# EAGLE design main (EAGLE 9.6.2)
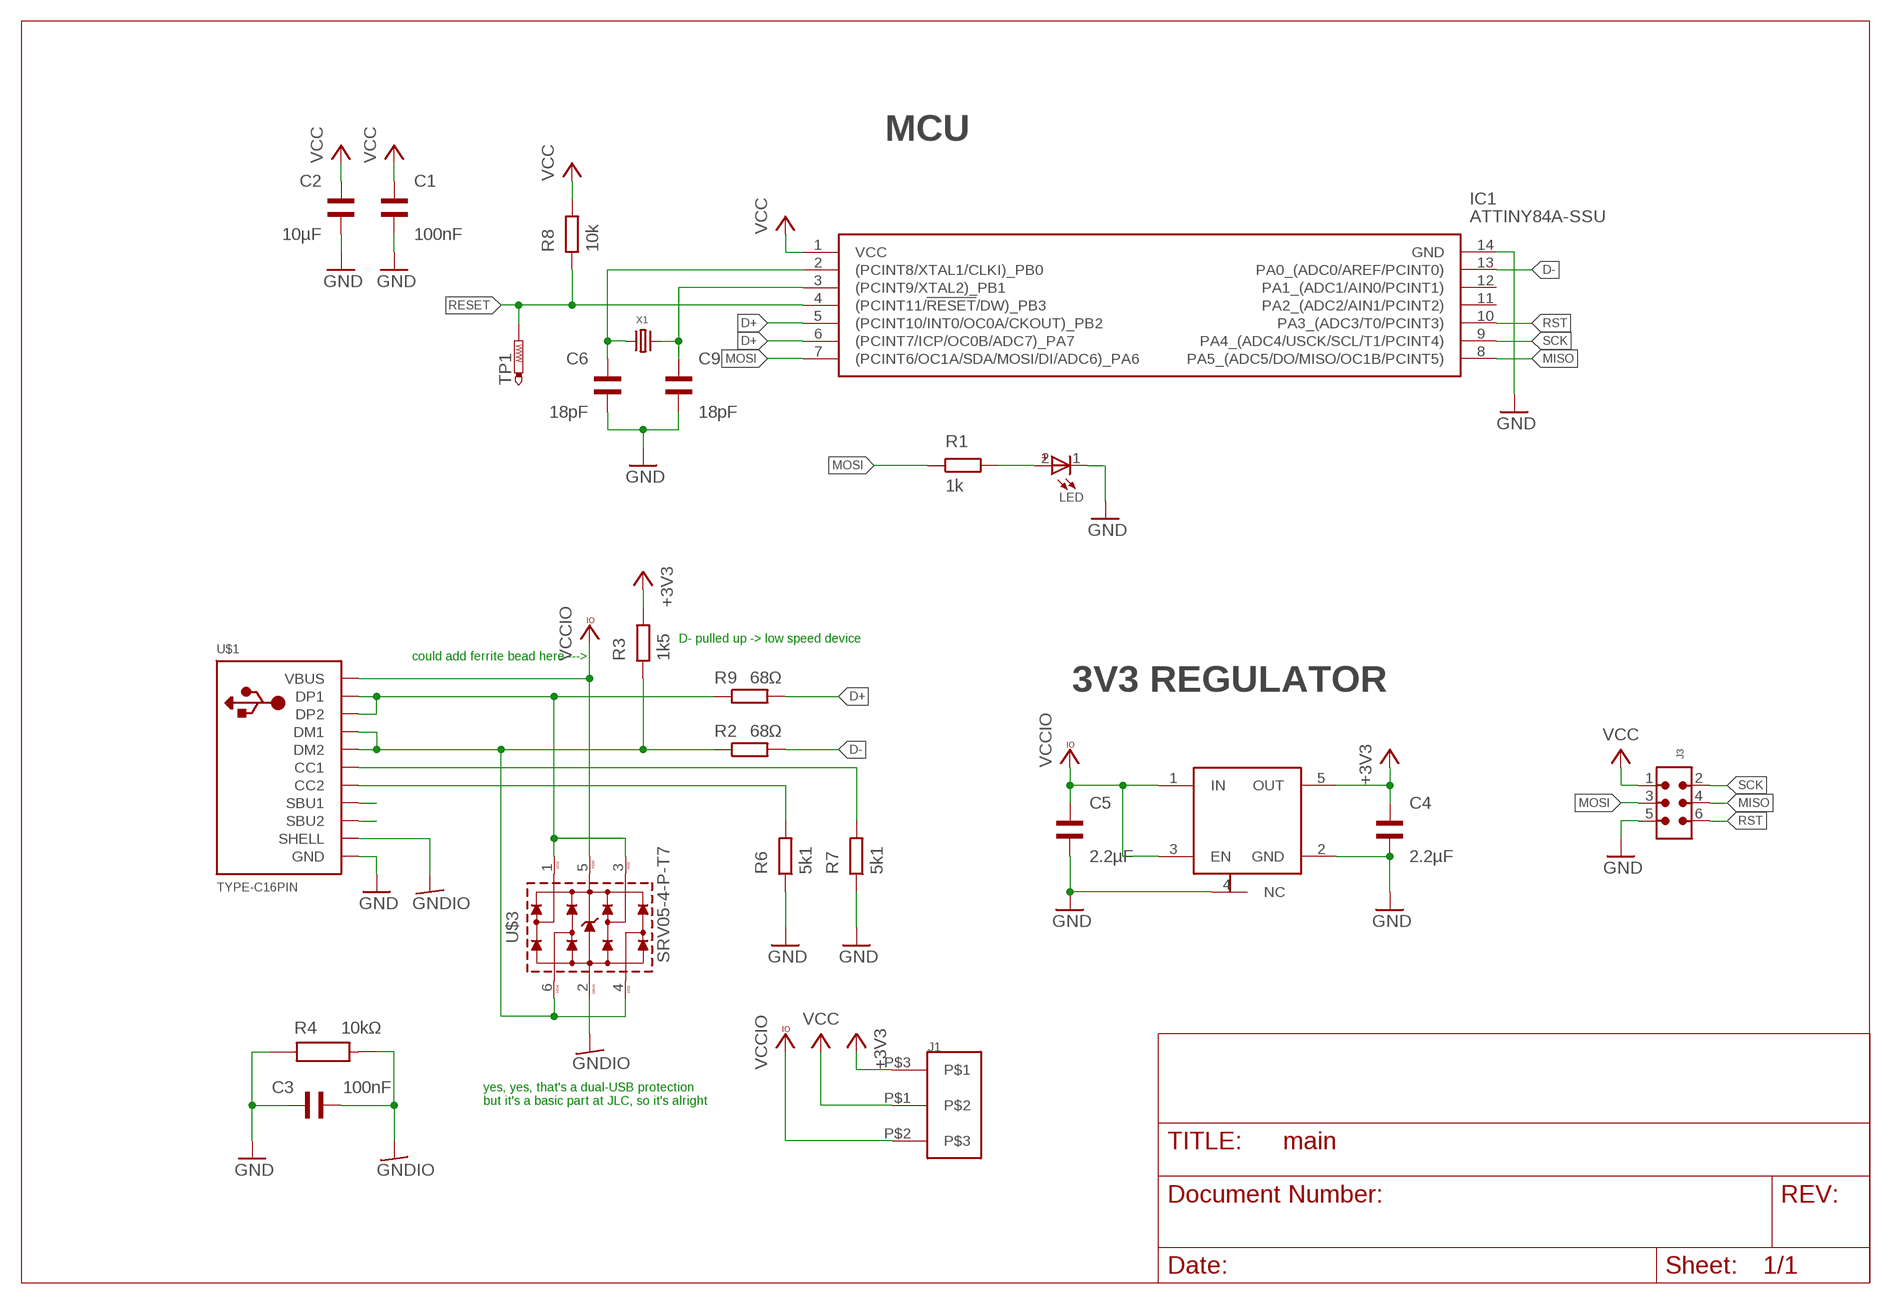
[diagram p0: schematic, sheet 1]

## Parts
C1  100nF  WCAP-CSGP_0603_885012206046_REFLOW  [WCAP-CSGP_0603_REFLOW]
C2  10µF  WCAP-CSGP_0603_885012106012_REFLOW  [WCAP-CSGP_0603_REFLOW]
C3  100nF  WCAP-CSGP_0603_885012206046_REFLOW  [WCAP-CSGP_0603_REFLOW]
C4  2.2µF  WCAP-CSGP_0603_885012206027_REFLOW  [WCAP-CSGP_0603_REFLOW]
C5  2.2µF  WCAP-CSGP_0603_885012206027_REFLOW  [WCAP-CSGP_0603_REFLOW]
C6  18pF  WCAP-CSGP_0603_885012206046_REFLOW  [WCAP-CSGP_0603_REFLOW]
C9  18pF  WCAP-CSGP_0603_885012206046_REFLOW  [WCAP-CSGP_0603_REFLOW]
IC1  ATTINY84A-SSU  [SOIC127P600X175-14N]
J1  JUMPER1.27  [1.27_JUMPER]
J3  6120XX21621_61200621621  [61200621621]
LED  WL-SMCW_0603_150060GS75000  [WL-SMCW_0603]
R1  1k  RESISTOR_0402  [WRIS-KSKE_0402]
R2  68Ω  RESISTOR_0402  [WRIS-KSKE_0402]
R3  1k5  RESISTOR_0402  [WRIS-KSKE_0402]
R4  10kΩ  WRIS-PSMB_0603_580060716001_1.6X0.8X0.35X0.6  [WRIS-PSMB_0603_1.6X0.8X0.35X0.6(LXWXHXPW)]
R6  5k1  RESISTOR_0402  [WRIS-KSKE_0402]
R7  5k1  RESISTOR_0402  [WRIS-KSKE_0402]
R8  10k  RESISTOR_0402  [WRIS-KSKE_0402]
R9  68Ω  RESISTOR_0402  [WRIS-KSKE_0402]
TP1  PTR1B1,27  [B1,27]
U$1  TYPE-C16PIN  [TYPE-C16PIN]
U$2  TLV75533PDBVRSOT-23-5  [DBV_R-PDSO-G5]
U$3  SRV05-4-P-T7  [SOT23-6]
X1  KMD160001210  [M-49USSMD]

## Nets
+3V3: C4.2 J1.P$3 R3.2 U$2.5(OUT)
D+: IC1.5((PCINT10/INT0/OC0A/CKOUT)_PB2) IC1.6((PCINT7/ICP/OC0B/ADC7)_PA7) R9.2
D+_RAW: R9.1 U$1.A6(DP1) U$1.B6(DP2) U$3.1(IO1) U$3.3(IO2)
D-: IC1.13(PA0_(ADC0/AREF/PCINT0)) R2.2
D-_RAW: R2.1 R3.1 U$1.A7(DM1) U$1.B7(DM2) U$3.4(IO3) U$3.6(IO4)
GND: C1.1 C2.1 C3.2 C4.1 C5.1 C6.1 C9.1 IC1.14(GND) J3.5 LED.1(-) R4.1 R6.1 R7.1 U$1.A1B12(GND) U$1.B1A12(GND) U$2.2(GND) U$2.4(NC)
GNDIO: C3.1 R4.2 U$1.SHELL1(SHELL) U$1.SHELL2(SHELL) U$1.SHELL3(SHELL) U$1.SHELL4(SHELL) U$3.2(GND)
MISO: IC1.8(PA5_(ADC5/DO/MISO/OC1B/PCINT5)) J3.4
MOSI: IC1.7((PCINT6/OC1A/SDA/MOSI/DI/ADC6)_PA6) J3.3 R1.1
N$1: LED.2(+) R1.2
N$12: R7.2 U$1.A5(CC1)
N$13: R6.2 U$1.B5(CC2)
N$14: U$1.A8(SBU1)
N$15: U$1.B8(SBU2)
N$18: C6.2 IC1.2((PCINT8/XTAL1/CLKI)_PB0) X1.P$1
N$19: C9.2 IC1.3((PCINT9/XTAL2)_PB1) X1.P$2
RESET: IC1.4((PCINT11/!RESET!/DW)_PB3) R8.1 TP1.TP
RST: IC1.10(PA3_(ADC3/T0/PCINT3)) J3.6
SCK: IC1.9(PA4_(ADC4/USCK/SCL/T1/PCINT4)) J3.2
VCC: C1.2 C2.2 IC1.1(VCC) J1.P$1 J3.1 R8.2
VCCIO: C5.2 J1.P$2 U$1.A4B9(VBUS) U$1.B4A9(VBUS) U$2.1(IN) U$2.3(EN) U$3.5(VDD)
Unconnected: IC1.11(PA2_(ADC2/AIN1/PCINT2)) IC1.12(PA1_(ADC1/AIN0/PCINT1))

## Notes on the sheet
- MCU
- D- pulled up -> low speed device
- could add ferrite bead here --->
- 3V3 REGULATOR
- yes, yes, that's a dual-USB protection
  but it's a basic part at JLC, so it's alright

## Library data of the parts
C1-C6 C9 = 885012206052_Eagle_WCAP-CSGP_rev19b (1):WCAP-CSGP_0603: WCAP-CSGP Ceramic Capacitors Characteristics Multilayer Ceramic Chip Capacitor Recommended soldering:Reflow, for 0603 and 0805 wave soldering is also allowed Operating temperature:-55 °C to +125 °C; Ceramic characteristics: Class I - NPO ; Class II -X7R, X5R High performance ceramic High capacitance stability Minimal aging Termination:Cu/Ni/Sn <http://katalog.we-online.de/media/images/eisos/WCAP-CSGP_pf2.jpg> Details see: http://katalog.we-online.de/en/pbs/WCAP-CSGP-0603? Created: 2015-01-28 2015 (C) Wurth Elektronik
IC1 = Salmiak:ATTINY84A-SSU: MCU 8-Bit AVR RISC 8KB Flash 2.5/3.3/5V Atmel ATTINY84A-SSU, 8bit AVR Microcontroller, 20MHz, 8 kB Flash, 14-Pin SOIC Source: Datasheet <https://componentsearchengine.com/Datasheets/2/ATTINY84A-SSU.pdf>; ARROW_PART_NUMBER: ATTINY84A-SSU; ARROW_PRICE-STOCK: https://www.arrow.com/en/products/attiny84a-ssu/microchip-technology; DESCRIPTION: MCU 8-Bit AVR RISC 8KB Flash 2.5/3.3/5V Atmel ATTINY84A-SSU, 8bit AVR Microcontroller, 20MHz, 8 kB Flash, 14-Pin SOIC; HEIGHT: 1.75mm; MANUFACTURER_NAME: Microchip; MANUFACTURER_PART_NUMBER: ATTINY84A-SSU; MOUSER_PART_NUMBER: 556-ATTINY84A-SSU; MOUSER_PRICE-STOCK: https://www.mouser.co.uk/ProductDetail/Microchip-Technology-Atmel/ATTINY84A-SSU?qs=JVB2vxgwrwzxqIGcOcTovQ%3D%3D
J1 = Lib_A:JUMPER1.27
J3 = 61200621621_Eagle_WR-BHD_rev19b:6120XX21621_61200621621: WR-BHD 2.54 mm Male Box Header KIND PROPERTIES: Pitch 2.54 mm Gender:Male MATERIAL PROPERTIES: Insulator Material:PBT Insulator Flammability Rating UL94 V-0 Insulator Color:Black Contact Material :Copper Alloy Contact Plating :Gold Contact Type: Stamped GENERAL INFORMATION: Operating Temperature:-40 °C up to +125 °C Compliance:RoHS Working Voltage: 250 V (AC) Withstanding Voltage:500 V (AC) Contact Resistance: 20 mΩ Insulation Resistance:1000 MΩ CERTIFICATION: UL Approval:E323964 PACKAGING PROPERTIES Packaging :Tray <https://katalog.we-online.com/media/images/v2/o32884v209%20Family_WR-BHD_6120xx21621.jpg> Details see: https://katalog.we-online.com/en/em/BHD_2_54_MALE_BOX_HEADER_6120XX21621 Updated by Yingchun,Shan 2019-10-29 2019 (C) Würth Elektronik; CONTACT-RESISTANCE: 20mOhm; DATASHEET-URL: https://katalog.we-online.com/em/datasheet/61200621621.pdf; GENDER: Male; IR: 3A; L: 15.28mm; MATES: WR-BHD 2.54mm Female IDC Connector with Strain Relief; MOUNT: THT; PACKAGING: Tray; PART-NUMBER: 61200621621; PINS: 6; PITCH: 2.54mm; TOL-R: max.; TYPE: Straight; WORKING-VOLTAGE: 250V(AC)
LED = 150080BS75000_Eagle_WL-SMCW_rev20b:WL-SMCW_0603: WL-SMCW SMT Mono-color Chip LED Waterclea Characteristics Low energy consumption High reliability Low current requirement Fast switching No UV/IR radiation Smallest SMD LED package for exceptional brightness Top view LED Wide viewing angle Better solder ability Heat dissipation Applications Backlight for mobile and portable device keypads Indoor and outdoor message boards Flat backlight for LCDs, switches and symbols Display for industrial control systems and traffic Miniaturized color effects Pedestrian mark Optical indicators Tabular backlight: LCD, telephone key-press, power-switch, display board Indoor displays Signals Identifiers Backlight for automobile DVD LED General lighting Toys <https://www.we-online.com/catalog/media/o14904v209%20Family_WL-SMCW.jpg> Details see: https://www.we-online.com/catalog/en/WL-SMCW/ Updated BY Yingchun,Shan 2020-03-18 2020(C) Wurth Elektronik; ABSTRAHLWINKEL: 140°; CHIP-TECHNOLOGY: InGaN; DATASHEET-URL: https://www.we-online.com/catalog/datasheet/150060GS75000.pdf; EMITTING-COLOR: Green; I-V-TYP: 430mcd; LAMDA-DOM-TYP: 525nm; LAMDA-PEAK-TYP: 515nm; PART-NUMBER: 150060GS75000; V-F-TYP: 3.2V
R1-R3 R6-R9 = Lib_A:RESISTOR_0402
R4 = 580060716001_Eagle_WRIS-PSMB_rev19a:WRIS-PSMB_0603: WRIS-PSMB Metal Plate Resistors Characteristics Metal plate resistors Recommended soldering: Reflow Operating temperature: -55 °C up to +155 °C Resistance range: 5 mΩ up to 10 mΩ Resistance tolerance: ±1 % Rated power: 0.33 W up to 1 W Enhanced current sensing Applications DMotor control Package name and Variant abbreviation: L X W X H X PW =Length X Width X Height X Pad Width <https://katalog.we-online.com/media/images/v2/o135743v209%20Family_WRIS-PSMB.jpg> Details see: https://katalog.we-online.com/en/pbs/WRIS-PSMB Created by Yingchun, Shan 2018-11-14 2018(C) Wurth Elektronik; DATASHEET-URL: https://katalog.we-online.de/pbs/datasheet/580060716001.pdf; IR: 8.12A; MOUNT: SMT; PART-NUMBER: 580060716001; PRATED: 0.33W; TCR: ±100ppm/ °C; TECHNICAL-REFERENCE: MB0603R005F103KAATP0000; VALUE: 5mOhm
TP1 = testpad:PTR1: TEST PIN
U$1 = Lib_A:TYPE-C16PIN
U$2 = Eigene Bauteile:TLV75533PDBVR
U$3 = Eigene Bauteile:SRV05-4-P-T7
X1 = Eigene Bauteile:KMD160001210

## Board
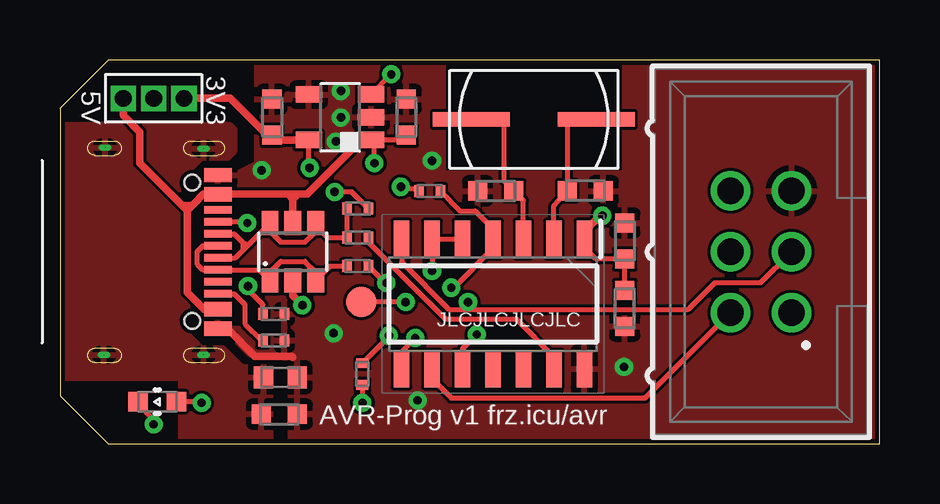
[diagram p1: board, top side]
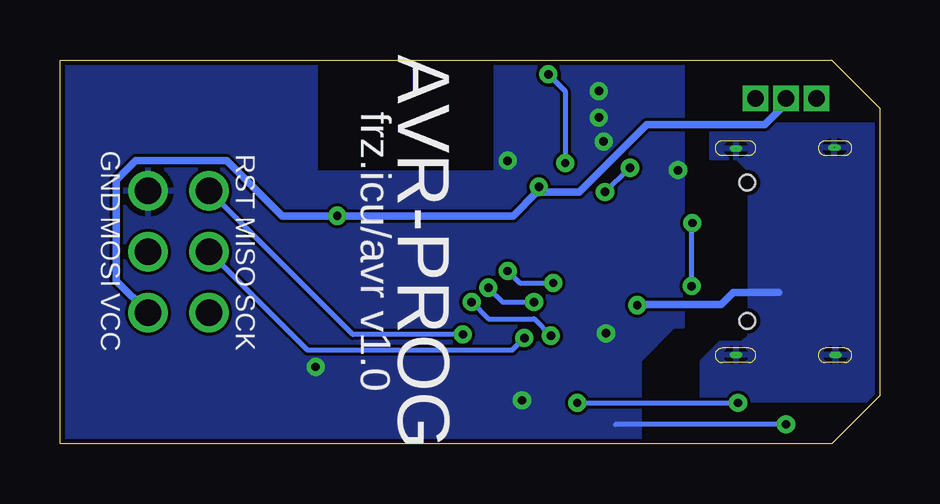
[diagram p2: board, bottom side, seen from below]

Size 34.15 x 16 mm. Coordinates in mm from the lower left corner, seen from the top.
Outline: 2,0 34.15,0 34.15,16 2,16 0,14 0,2 2,0
Copper layers (1*16): Top 0.035mm / dielectric 1.5mm / Bottom 0.035mm
Design rules "default *": minimum track width 5mil, minimum drill 0.2mm, track to track 5mil, track to pad 6mil, pad to pad 6mil, via to via 6mil, smd to smd 6mil, copper to edge 0.2mm, drill to drill 6mil, minimum pad ring 0.13mm, minimum via ring 8mil, stop-mask expansion 4mil, vias tented up to drill 100mil, thermal gap 10mil
tRestrict: area 16.1,11.4 to 23.4,15.7; area -2.4,-1.7 to 4.9,2.6
bRestrict: area 16.1,11.4 to 23.4,15.7; area 0.1,-2.6 to 7.4,1.7

### Footprints (pad centres in the part's own frame; a part is rotated, then mirrored left to right if it is on the bottom)
WCAP-CSGP_0603_REFLOW = smd 0.8 x 0.8: 1 -0.75,0; 2 0.75,0
SOIC127P600X175-14N = smd 1.528 x 0.65: 1 -2.711,3.81; 2 -2.711,2.54; 3 -2.711,1.27; 4 -2.711,0; 5 -2.711,-1.27; 6 -2.711,-2.54; 7 -2.711,-3.81; 8 2.711,-3.81; 9 2.711,-2.54; 10 2.711,-1.27; 11 2.711,0; 12 2.711,1.27; 13 2.711,2.54; 14 2.711,3.81
1.27_JUMPER = drill 0.7 pad 0.9 square: P$1 0,0; P$2 -1.27,0; P$3 1.27,0
61200621621 = drill 1.1: 1 -2.54,-1.27; 2 -2.54,1.27; 3 0,-1.27; 4 0,1.27; 5 2.54,-1.27; 6 2.54,1.27
WL-SMCW_0603 = smd 0.8 x 0.8: 1 -0.8,0; 2 0.8,0
WRIS-KSKE_0402 = smd 0.4 x 0.5: 1 -0.45,0; 2 0.45,0
WRIS-PSMB_0603_1.6X0.8X0.35X0.6(LXWXHXPW) = smd 0.8 x 0.9: 1 -0.7,0; 2 0.7,0
B1,27 = smd 1.27 x 1.27: TP 0,0
TYPE-C16PIN = smd 0.6 x 1.15: A1B12 -3.2,0; A4B9 -2.4,0; B1A12 3.2,0; B4A9 2.4,0 | smd 0.3 x 1.15: A5 -1.25,0; A6 -0.25,0; A7 0.25,0; A8 -1.75,0; B5 1.75,0; B6 0.75,0; B7 -0.75,0; B8 1.25,0 | drill 0.01 long: SHELL1 -4.3,-0.6; SHELL2 4.3,-0.6; SHELL3 -4.35,-4.7; SHELL4 4.3,-4.75 | hole 0.65: -2.89,-1.075; 2.89,-1.075
DBV_R-PDSO-G5 = smd 0.69 x 1.1: 1 -0.95,-1.29; 2 0,-1.29; 3 0.95,-1.29; 4 0.95,1.3; 5 -0.95,1.3
SOT23-6 = smd 0.7 x 1: 1 -0.95,-1.2; 2 0,-1.2; 3 0.95,-1.2; 4 0.95,1.2; 5 0,1.2; 6 -0.95,1.2
M-49USSMD = smd 3.2 x 0.62: P$1 -2.6,0; P$2 2.6,0

### Placement (x,y rotation side)
C1  23.53,5.64 90 top
C2  23.53,8.45 270 top
C3  9.14,1.23 0 top
C4  8.83,13.61 270 top
C5  14.43,13.61 270 top
C6  21.89,10.54 180 top
C9  18.16,10.54 0 top
IC1  18.04,5.82 270 top
J1  3.9,14.4 0 top
J3  29.21,8 90 top
LED  4.05,1.75 0 top
R1  12.6,2.9 270 top
R2  12.4,8.6 0 top
R3  12.4,9.8 0 top
R4  9.18,2.76 180 top
R6  8.9,4.3 180 top
R7  8.9,5.4 180 top
R8  15.4,10.54 180 top
R9  12.4,7.4 0 top
TP1  12.55,5.91 0 top
U$1  6.58,8 270 top
U$2  11.67,13.61 90 top
U$3  9.7,8 0 top
X1  19.74,13.52 180 top

### Tracks (layer width: path | path; a pad name or v marks a point on that pad's centre or on a via)
+3V3  (via drill 0.35)
  Top 0.203: R3.2 12.16,10.49 v11.44,10.49 | v10.4,11.5 10.37,11.53 U$2.5
  Top 0.305: U$2.5 9.03,12.66 C4.2 8.63,12.86 7.09,14.4 J1.P$3
  Bottom 0.203: v11.44,10.49 10.43,11.5 v10.4,11.5
D+  (via drill 0.35)
  Top 0.203: IC1.5 IC1.6 v15.5,7.2 | R9.2 13.55,6.7 v13.6,6.7
  Bottom 0.203: v15.5,7.2 15,6.7 v13.6,6.7
D+_RAW
  Top 0.203: U$1.A6 5.95,8.25 5.7,8 5.7,7.5 5.95,7.25 U$1.B6 8.3,7.25 U$3.1 8.75,7.15 9.2,7.6 10.2,7.6 10.65,7.15 U$3.3 11.25,7.4 R9.1
D-
  Top 0.152: R2.2 12.85,8.4
  Top 0.203: 12.85,8.4 16.05,5.2 19,5.2 20.58,3.62 IC1.13
D-_RAW
  Top 0.203: U$1.A7 7.3,7.75 7.61,8.06 | 7.61,8.06 7.78,8.22 | 7.78,8.22 7.88,8.32 | 7.88,8.32 U$3.6 8.75,8.85 9.2,8.4 10.2,8.4 10.65,8.85 U$3.4 10.65,9.1 11.15,8.6 R2.1 R3.1 | U$1.B7 7.25,8.75 7.61,8.39 | 7.61,8.39 7.7,8.3 | 7.78,8.22 7.7,8.3 | 7.61,8.39 7.61,8.06 | 7.7,8.3 7.73,8.32 7.88,8.32
GND  (via drill 0.35)
  Top 0.203: LED.1 3.25,1.65 3.9,1 v3.9,0.8
  Top 0.305: 9.7,3.6 9.66,3.64 8.12,3.64 6.97,4.8 U$1.B1A12
  Bottom 0.203: v3.9,0.8 11,0.8
  other vias: 8.4,11.4 11.4,4.6 14.9,1.8 15.5,11.8 23.5,3.2 11.7,14.7 11.5,12.6 11.7,13.6
  pour Bottom: 10,0 10,3.5 8.6,4.9 8.2,4.9 8.2,15.9 8.3,16 34.2,16 34.2,0
  pour Top: 9.6,0 9.6,3.3 9.2,3.7 7.9,3.7 6.9,4.7 6.2,4.7 6.2,11.3 7.4,11.3 8.2,11.7 8.2,15.9 8.3,16 34.2,16 34.2,0
GNDIO  (via drill 0.35)
  Top 0.305: U$3.2 9.7,6.17 v10.1,5.77
  Bottom 0.305: 4.2,6.3 6.1,6.3 6.6,5.8 10.07,5.8 v10.1,5.77
  pour Top: 8.8,0 8.8,3.2 7.6,3.2 6.8,4 5.9,4 5.4,4.5 5.4,11.4 5.9,11.9 7,11.9 7.3,12.2 7.3,13.1 7.1,13.3 0,13.3 0,2 2,0
  pour Bottom: 7.4,0 7.4,3.4 6.6,4.2 5.7,4.2 5.4,4.5 5.4,11.4 5.9,11.9 7,11.9 7,13.3 0,13.3 0,2 2,0
MISO  (via drill 0.35)
  Top 0.203: IC1.8 14.23,3.83 v14.8,4.4
  Bottom 0.203: v14.8,4.4 15.3,3.9 23.84,3.9 J3.4
MOSI  (via drill 0.35)
  Top 0.203: IC1.7 14.23,7.57 16.2,5.6 17,5.6 | J3.3 29.18,6.7 27.28,6.7 26.18,5.6 17,5.6 | v13.7,4.5 13.7,4.45 R1.1 | v17,5.9 17,5.6
  Bottom 0.203: v17,5.9 16.3,5.2 14.4,5.2 v13.7,4.5
N$1  (via drill 0.35)
  Top 0.203: R1.2 v12.6,1.7 | v5.9,1.7 5.85,1.75 LED.2
  Bottom 0.203: v12.6,1.7 v5.9,1.7
N$12  (via drill 0.35)
  Top 0.203: R7.2 8.45,5.8 7.83,6.42 v7.83,6.57 | v7.8,9.2 7.75,9.25 U$1.A5
  Bottom 0.203: v7.83,6.57 7.83,9.17 v7.8,9.2
N$13
  Top 0.203: U$1.B5 7.25,6.25 7.7,5.8 7.7,5 8.4,4.3 R6.2
N$18
  Top 0.203: IC1.2 20.58,9.91 C6.2 21.14,13.42 21.24,13.52 X1.P$1
N$19
  Top 0.203: IC1.3 19.31,10.14 C9.2 18.5,10.95 18.5,13.52 X1.P$2
RESET  (via drill 0.35)
  Top 0.203: R8.1 16.65,9.7 17.3,9.7 18.04,8.96 IC1.4 18.04,8.13 16.41,6.5 v16.3,6.5 | TP1.TP v14.4,5.9
  Bottom 0.203: v14.4,5.9 15.7,5.9 v16.3,6.5
RST  (via drill 0.35)
  Top 0.203: v17.37,4.55 16.77,3.96 IC1.10
  Bottom 0.203: v17.37,4.55 21.95,4.55 J3.6
SCK
  Top 0.203: IC1.9 15.5,2.7 16.3,1.9 24.38,1.9 J3.2
VCC  (via drill 0.35)
  Top 0.203: C1.2 C2.2 22.33,7.7 21.85,8.18 IC1.1 21.9,8.53 | R8.2 14.87,10.61 14.3,10.61 v14.2,10.71
  Top 0.305: v22.6,9.5 22.5,9.5 21.9,8.9 21.9,8.53
  Bottom 0.203: v14.2,10.71 14.2,10.48
  Bottom 0.305: J1.P$1 3.9,14.19 4.79,13.3 9.7,13.3 12.52,10.48 14.2,10.48 14.28,10.48 15.27,9.5 v22.6,9.5 24.9,9.5 27.2,11.8 31,11.8 31.8,11 31.8,6.78 J3.1
VCCIO  (via drill 0.35)
  Top 0.152: 5.01,10.01 5.59,10.01
  Top 0.203: C5.2 14.23,12.66 U$2.1 12.85,12.55 12.45,12.55 | U$2.3 v13.8,15.4 | v13.1,11.7 13.1,12.5 12.94,12.66
  Top 0.305: U$1.B4A9 6,5.6 5.3,6.3 5.3,9.73 | 5.3,9.73 5.59,10.01 5.97,10.4 U$1.A4B9 9.5,10.4 | 9.5,10.4 9.7,10.2 | U$3.5 9.7,10.2 | U$2.1 12.94,12.66 | 12.45,12.55 10.3,10.4 9.9,10.4 | 9.9,10.4 9.5,10.4 | 9.7,10.2 9.9,10.4 | J1.P$2 2.63,13.7 3.33,13 3.33,11.7 5.01,10.01 5.3,9.73
  Bottom 0.203: v13.8,15.4 13.1,14.7 v13.1,11.7

### Text on the board
tNames: 5V | 3V3 | JLCJLCJLCJLC | AVR-Prog v1 frz.icu/avr
bNames: RST | GND | AVR-PROG | frz.icu/avr v1.0 | MISO | MOSI | SCK | VCC